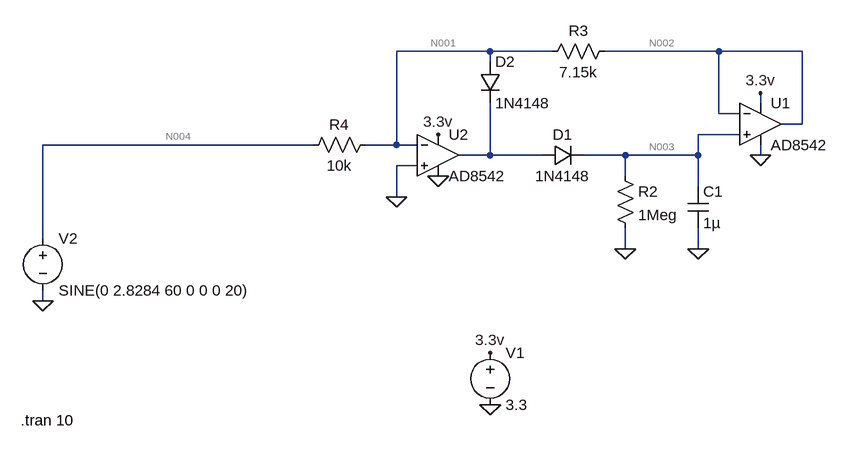
[diagram p0: schematic currentMon.asc]
currentMon.asc, the LTspice schematic file:
Version 4
SHEET 1 1184 680
WIRE 240 -32 96 -32
WIRE 336 -32 240 -32
WIRE 592 -32 416 -32
WIRE 720 -32 592 -32
WIRE 240 -16 240 -32
WIRE 656 48 656 32
WIRE 592 64 592 -32
WIRE 624 64 592 64
WIRE 720 80 720 -32
WIRE 720 80 688 80
WIRE 624 96 560 96
WIRE -32 112 -448 112
WIRE 96 112 96 -32
WIRE 96 112 48 112
WIRE 128 112 96 112
WIRE 240 128 240 48
WIRE 240 128 192 128
WIRE 320 128 240 128
WIRE 448 128 384 128
WIRE 560 128 560 96
WIRE 560 128 448 128
WIRE 656 128 656 112
WIRE 128 144 96 144
WIRE 448 160 448 128
WIRE 560 176 560 128
WIRE 96 192 96 144
WIRE -448 256 -448 112
WIRE 448 272 448 240
WIRE 560 272 560 240
WIRE -448 352 -448 336
FLAG 240 512 0
FLAG 240 432 3.3v
FLAG 160 160 0
FLAG 160 96 3.3v
FLAG 448 272 0
FLAG 560 272 0
FLAG 656 32 3.3v
FLAG 656 128 0
FLAG -448 352 0
FLAG 96 192 0
SYMBOL voltage 240 416 R0
WINDOW 123 0 0 Left 0
WINDOW 39 0 0 Left 0
SYMATTR InstName V1
SYMATTR Value 3.3
SYMBOL diode 320 144 R270
WINDOW 0 32 32 VTop 2
WINDOW 3 0 32 VBottom 2
SYMATTR InstName D1
SYMATTR Value 1N4148
SYMBOL diode 224 -16 R0
SYMATTR InstName D2
SYMATTR Value 1N4148
SYMBOL res 432 144 R0
SYMATTR InstName R2
SYMATTR Value 1Meg
SYMBOL cap 544 176 R0
SYMATTR InstName C1
SYMATTR Value 1µ
SYMBOL res 432 -48 R90
WINDOW 0 0 56 VBottom 2
WINDOW 3 32 56 VTop 2
SYMATTR InstName R3
SYMATTR Value 7.15k
SYMBOL voltage -448 240 R0
WINDOW 123 0 0 Left 0
WINDOW 39 0 0 Left 0
SYMATTR InstName V2
SYMATTR Value SINE(0 2.8284 60 0 0 0 20)
SYMBOL res 64 96 R90
WINDOW 0 0 56 VBottom 2
WINDOW 3 32 56 VTop 2
SYMATTR InstName R4
SYMATTR Value 10k
SYMBOL OpAmps\\AD8542 656 16 R0
SYMATTR InstName U1
SYMBOL OpAmps\\AD8542 160 64 R0
SYMATTR InstName U2
TEXT -482 536 Left 2 !.tran 10

The netlist it stands for:
* currentMon.asc
V1 3.3v 0 3.3
D1 N005 N003 1N4148
D2 N001 N005 1N4148
R2 N003 0 1Meg
C1 N003 0 1µ
R3 N002 N001 7.15k
V2 N004 0 SINE(0 2.8284 60 0 0 0 20)
R4 N001 N004 10k
XU1 N003 N002 3.3v 0 N002 AD8542  ; pins In+ In- V+ V- OUT
XU2 0 N001 3.3v 0 N005 AD8542  ; pins In+ In- V+ V- OUT
.model D D
.lib standard.dio
.tran 10
.lib AD8542.sub
.backanno
.end

* Results of the author's LTspice run, read from the files saved beside the schematic
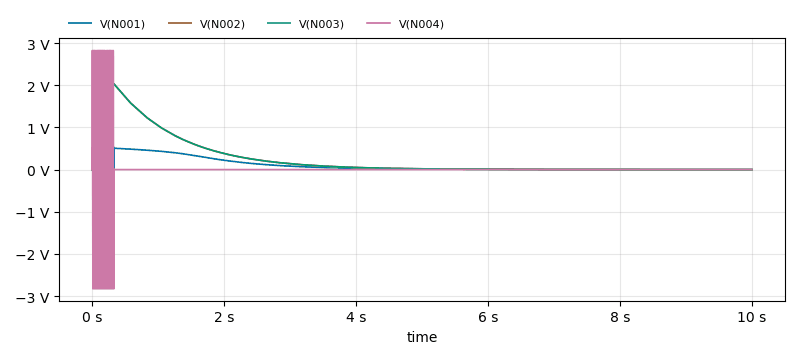
[diagram p1: Transient Analysis of currentMon.asc, plotted from the saved traces]
* Transient Analysis, 1 run:
*   V(N001): min -30.25 mV, max 557.9 mV, average 100.9 mV, rms 189.7 mV, last 85.45 µV
*   V(N002): min -930.5 µV, max 2.036 V, average 267.8 mV, rms 583.2 mV, last 146.6 µV
*   V(N003): min 35.95 µV, max 2.037 V, average 267.9 mV, rms 583.6 mV, last 88.1 µV
*   V(N004): min -2.828 V, max 2.828 V, average -157 µV, rms 367.7 mV, last 0 V